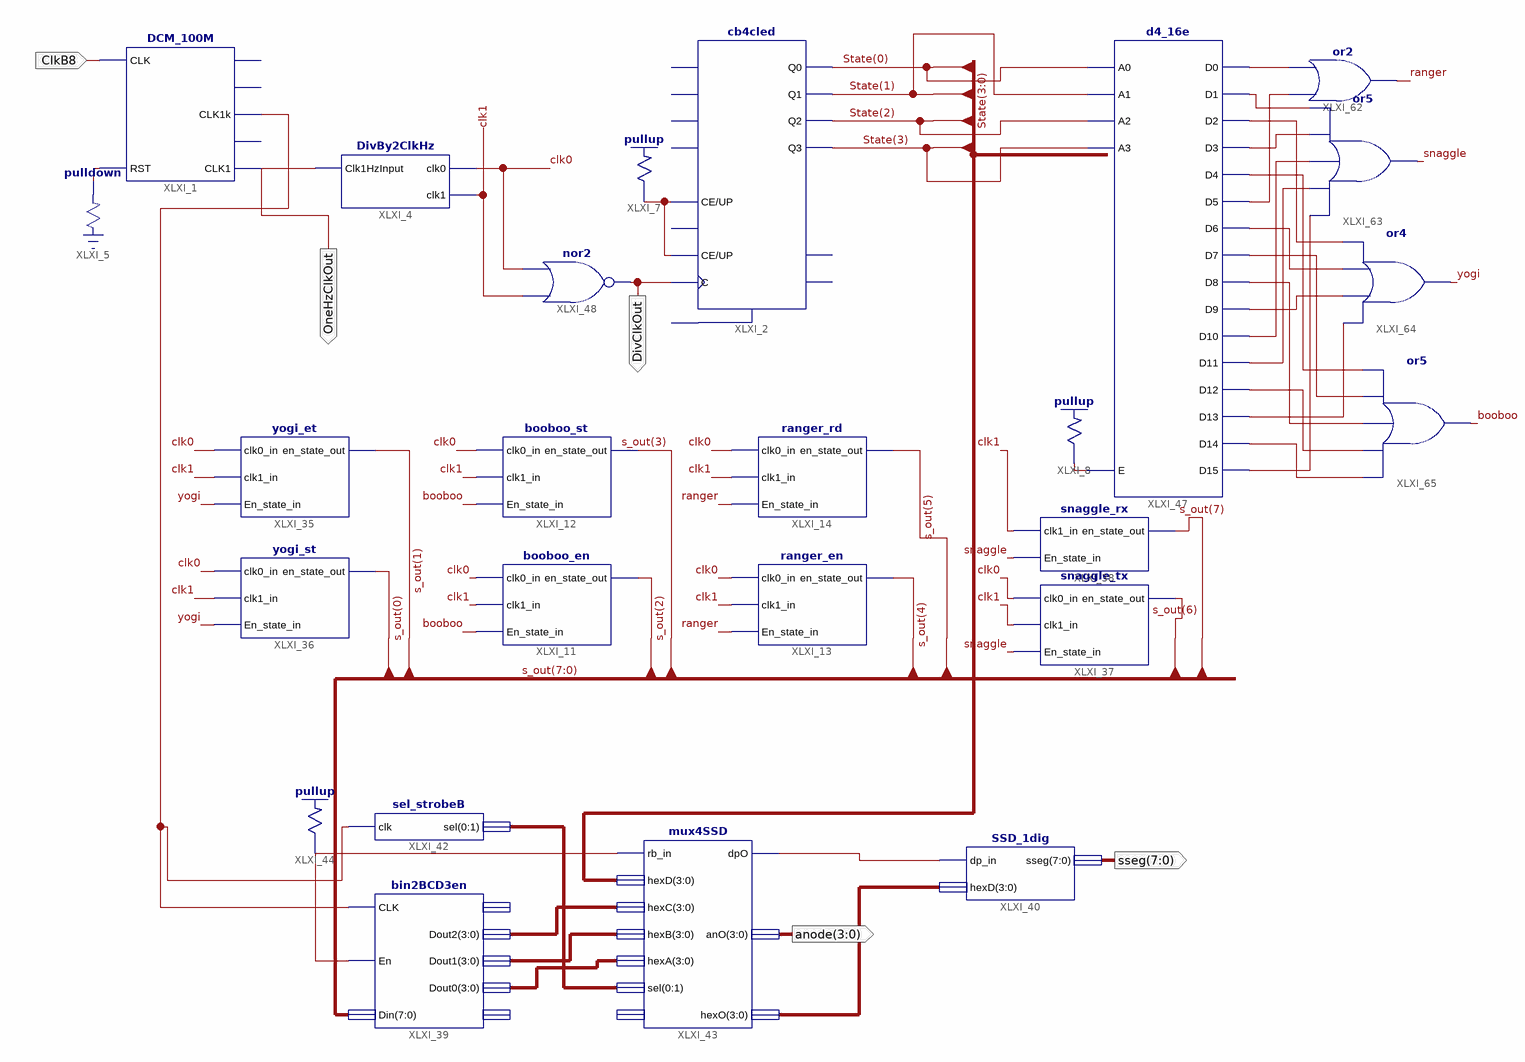
[diagram p0: schematic sheet 1]
// Xilinx ISE schematic basicMachine.sch (spartan3e) as structural Verilog: 25 symbols, 5 ports
module basicMachine (
  input  ClkB8,
  output OneHzClkOut,
  output DivClkOut,
  output [3:0] anode,
  output [7:0] sseg
);

  wire booboo, clk0, clk1, ranger, snaggle, XLXN_2, XLXN_7, XLXN_72, XLXN_77, XLXN_81, XLXN_89, XLXN_206,
       XLXN_207, XLXN_209, XLXN_214, XLXN_215, XLXN_216, XLXN_217, XLXN_218, XLXN_219, XLXN_220, XLXN_221,
       XLXN_223, XLXN_224, XLXN_225, XLXN_226, XLXN_227, yogi;
  wire [1:0] XLXN_66;
  wire [3:0] State, XLXN_73, XLXN_74, XLXN_75, XLXN_76;
  wire [7:0] s_out;

  DCM_100M XLXI_1 (.CLK(ClkB8), .RST(XLXN_2), .CLK1k(XLXN_81), .CLK1(OneHzClkOut));  // open: CLK1M, CLK10k, CLK100
  cb4cled XLXI_2 (
    .C(DivClkOut), .CE(XLXN_7), .UP(XLXN_7), .Q0(State[0]), .Q1(State[1]), .Q2(State[2]), .Q3(State[3]));  // open: CLR, D0, D1, D2, D3, L, CEO, TC
  DivBy2ClkHz XLXI_4 (.Clk1HzInput(OneHzClkOut), .clk0(clk0), .clk1(clk1));
  \pulldown  XLXI_5 (.O(XLXN_2));
  \pullup  XLXI_7 (.O(XLXN_7));
  \pullup  XLXI_8 (.O(XLXN_89));
  bin2BCD3en XLXI_39 (
    .CLK(XLXN_81), .En(XLXN_72), .Din(s_out), .Dout2(XLXN_73), .Dout1(XLXN_74), .Dout0(XLXN_75));  // open: Dout3, RBout
  SSD_1dig XLXI_40 (.dp_in(XLXN_77), .hexD(XLXN_76), .sseg(sseg));
  sel_strobeB XLXI_42 (.clk(XLXN_81), .sel({XLXN_66[0], XLXN_66[1]}));
  mux4SSD XLXI_43 (
    .rb_in(XLXN_72), .hexD(State), .hexC(XLXN_73), .hexB(XLXN_74), .hexA(XLXN_75),
    .sel({XLXN_66[0], XLXN_66[1]}), .dpO(XLXN_77), .anO(anode), .hexO(XLXN_76));  // open: dp_in
  \pullup  XLXI_44 (.O(XLXN_72));
  d4_16e XLXI_47 (
    .A0(State[0]), .A1(State[1]), .A2(State[2]), .A3(State[3]), .E(XLXN_89), .D0(XLXN_206), .D1(XLXN_209),
    .D10(XLXN_215), .D11(XLXN_216), .D12(XLXN_226), .D13(XLXN_221), .D14(XLXN_227), .D15(XLXN_217),
    .D2(XLXN_218), .D3(XLXN_214), .D4(XLXN_223), .D5(XLXN_207), .D6(XLXN_219), .D7(XLXN_224), .D8(XLXN_225),
    .D9(XLXN_220));
  nor XLXI_48 (DivClkOut, clk1, clk0);
  snaggle_tx XLXI_37 (.clk0_in(clk0), .clk1_in(clk1), .En_state_in(snaggle), .en_state_out(s_out[6]));
  snaggle_rx XLXI_38 (.clk1_in(clk1), .En_state_in(snaggle), .en_state_out(s_out[7]));
  yogi_st XLXI_36 (.clk0_in(clk0), .clk1_in(clk1), .En_state_in(yogi), .en_state_out(s_out[0]));
  yogi_et XLXI_35 (.clk0_in(clk0), .clk1_in(clk1), .En_state_in(yogi), .en_state_out(s_out[1]));
  ranger_rd XLXI_14 (.clk0_in(clk0), .clk1_in(clk1), .En_state_in(ranger), .en_state_out(s_out[5]));
  ranger_en XLXI_13 (.clk0_in(clk0), .clk1_in(clk1), .En_state_in(ranger), .en_state_out(s_out[4]));
  booboo_st XLXI_12 (.clk0_in(clk0), .clk1_in(clk1), .En_state_in(booboo), .en_state_out(s_out[3]));
  booboo_en XLXI_11 (.clk0_in(clk0), .clk1_in(clk1), .En_state_in(booboo), .en_state_out(s_out[2]));
  or XLXI_62 (ranger, XLXN_207, XLXN_206);
  or XLXI_63 (snaggle, XLXN_217, XLXN_216, XLXN_215, XLXN_214, XLXN_209);
  or XLXI_64 (yogi, XLXN_221, XLXN_220, XLXN_219, XLXN_218);
  or XLXI_65 (booboo, XLXN_227, XLXN_226, XLXN_225, XLXN_224, XLXN_223);
endmodule
